# EAGLE design verstaerker (EAGLE 6.2)
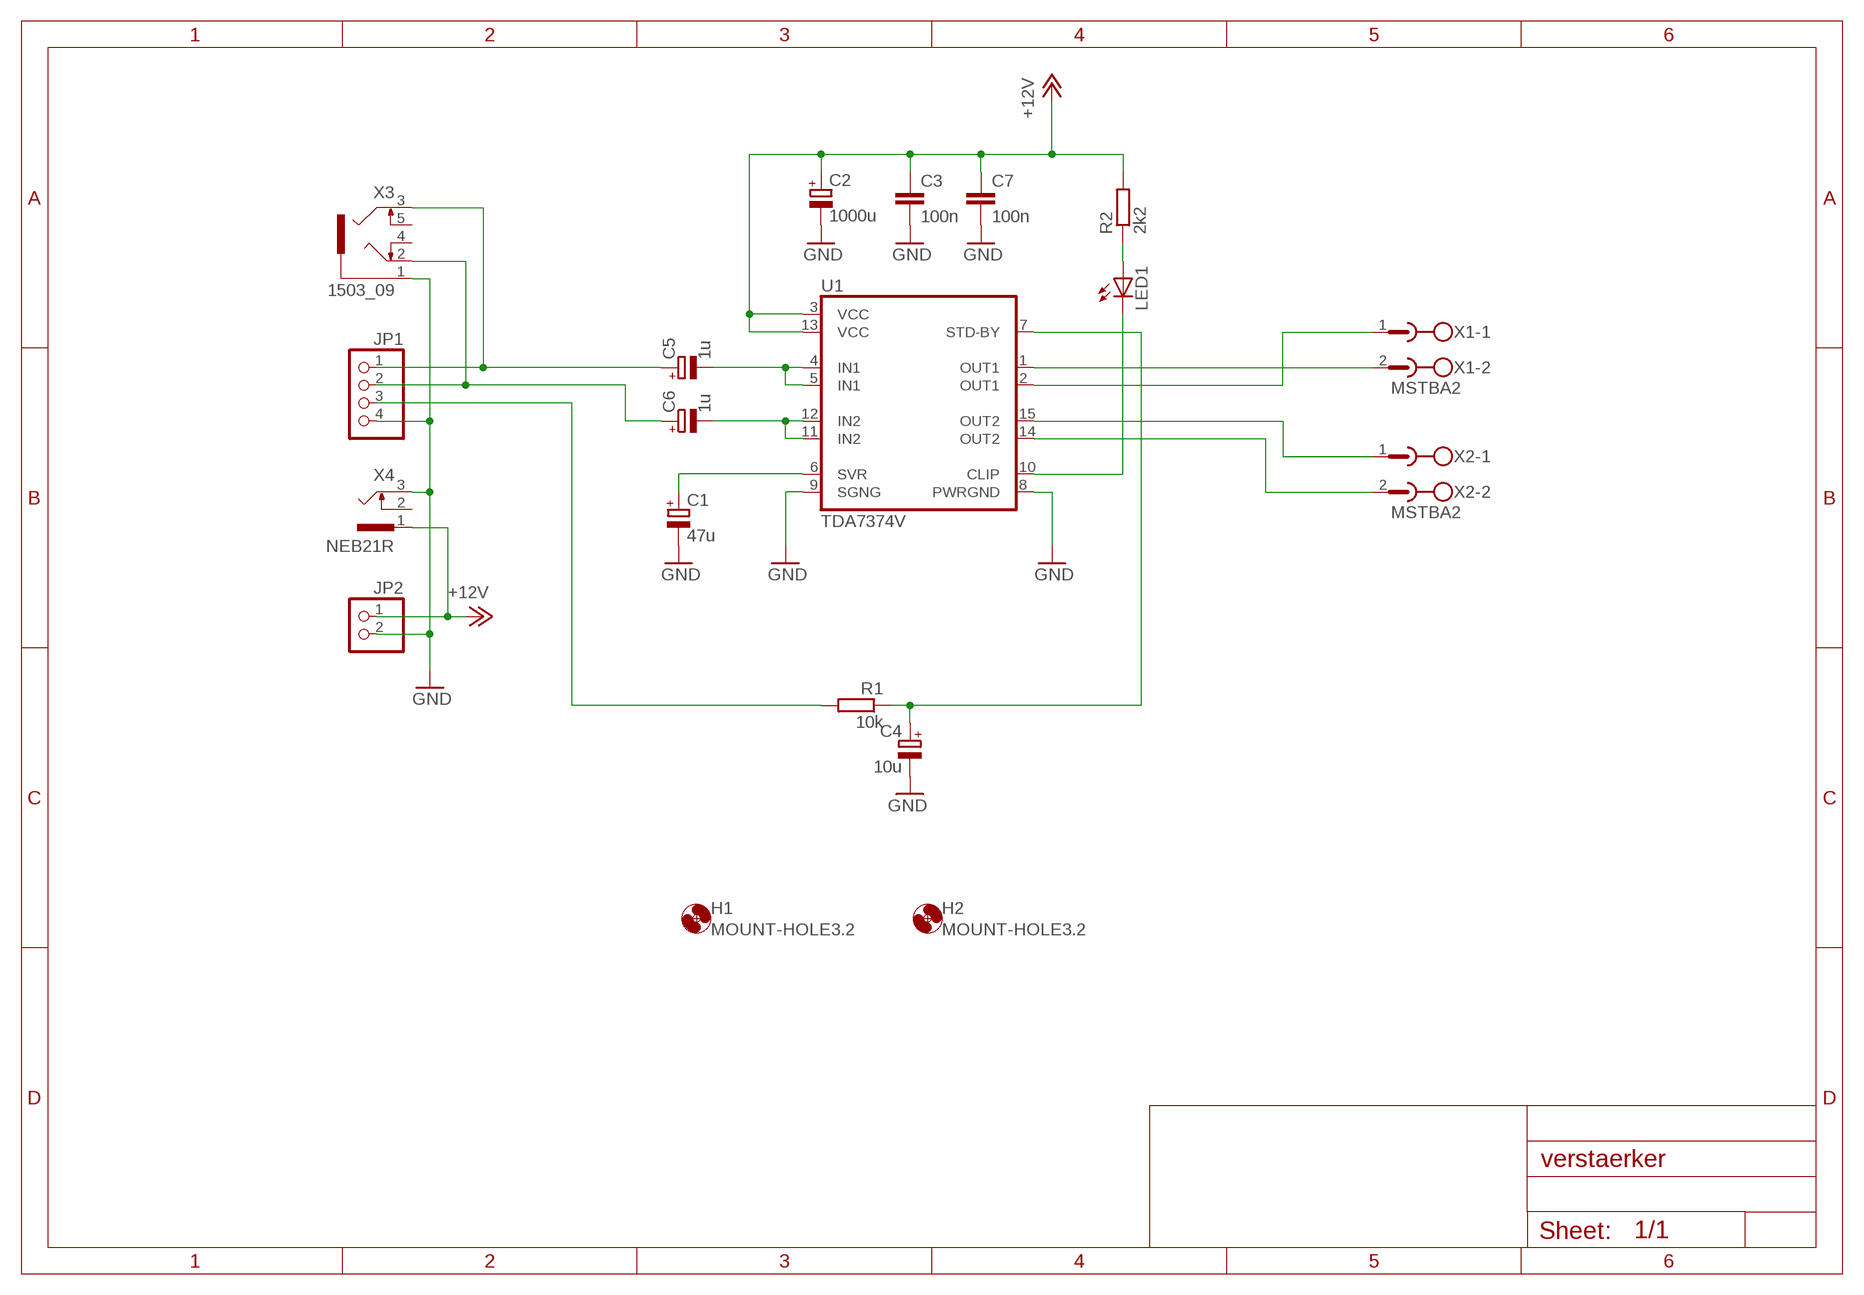
[diagram p0: schematic, sheet 1]

## Parts
C1  47u  CPOL-EUE2.5-7  [E2,5-7]
C2  1000u  CPOL-EUE3.5-8  [E3,5-8]
C3  100n  C-EU050-025X075  [C050-025X075]
C4  10u  CPOL-EUE2-5  [E2-5]
C5  1u  CPOL-EUE2.5-5  [E2,5-5]
C6  1u  CPOL-EUE2.5-5  [E2,5-5]
C7  100n  C-EU050-025X075  [C050-025X075]
H1  MOUNT-HOLE3.2  [3,2]
H2  MOUNT-HOLE3.2  [3,2]
JP1  PINHD-1X4  [1X04]
JP2  PINHD-1X2  [1X02]
LED1  LED5MM  [LED5MM]
R1  10k  R-EU_R0805  [R0805]
R2  2k2  R-EU_R0805  [R0805]
U1  TDA7374V  [MULTIWATT-15V]
X1  MSTBA2  [MSTBA2]
X2  MSTBA2  [MSTBA2]
X3  1503_09  [1503_09]
X4  NEB21R  [NEB21R]

## Nets
+12V: C2.+ C3.1 C7.1 JP2.1 R2.2 U1.3(VCC) U1.13(VCC) X4.1
GND: C1.- C2.- C3.2 C4.- C7.2 JP1.4 JP2.2 U1.8(PWRGND) U1.9(SGNG) X3.1 X4.3
N$1: C1.+ U1.6(SVR)
N$2: LED1.K(C) U1.10(CLIP)
N$3: C4.+ R1.1 U1.7(STD-BY)
N$4: JP1.3 R1.2
N$5: C5.+ JP1.1 X3.3
N$6: C6.- U1.11(IN2) U1.12(IN2)
N$7: LED1.A R2.1
N$8: C6.+ JP1.2 X3.2
N$9: C5.- U1.4(IN1) U1.5(IN1)
N$10: U1.1(OUT1) X1.2
N$11: U1.2(OUT1) X1.1
N$12: U1.14(OUT2) X2.2
N$13: U1.15(OUT2) X2.1
Unconnected: X3.4 X3.5 X4.2

## Library data of the parts
C1 C2 C4-C6 = rcl:CPOL-EU: POLARIZED CAPACITOR, European symbol
C3 C7 = rcl:C-EU: CAPACITOR, European symbol
H1 H2 = holes:MOUNT-HOLE: MOUNTING HOLE with drill center marker
JP1 = pinhead:PINHD-1X4: PIN HEADER
JP2 = pinhead:PINHD-1X2: PIN HEADER
LED1 = led:LED: LED OSRAM: - CHIPLED LG R971, LG N971, LY N971, LG Q971, LY Q971, LO R971, LY R971 LH N974, LH R974 LS Q976, LO Q976, LY Q976 LO Q996 - Hyper CHIPLED LW Q18S LB Q993, LB Q99A, LB R99A - SideLED LS A670, LO A670, LY A670, LG A670, LP A670 LB A673, LV A673, LT A673, LW A673 LH A674 LY A675 LS A676, LA A676, LO A676, LY A676, LW A676 LS A679, LY A679, LG A679 - Hyper Micro SIDELED® LS Y876, LA Y876, LO Y876, LY Y876 LT Y87S - SmartLED LW L88C, LW L88S LB L89C, LB L89S, LG L890 LS L89K, LO L89K, LY L89K LS L896, LA L896, LO L896, LY L896 - TOPLED LS T670, LO T670, LY T670, LG T670, LP T670 LSG T670, LSP T670, LSY T670, LOP T670, LYG T670 LG T671, LOG T671, LSG T671 LB T673, LV T673, LT T673, LW T673 LH T674 LS T676, LA T676, LO T676, LY T676, LB T676, LH T676, LSB T676, LW T676 LB T67C, LV T67C, LT T67C, LS T67K, LO T67K, LY T67K, LW E67C LS E67B, LA E67B, LO E67B, LY E67B, LB E67C, LV E67C, LT E67C LW T67C LS T679, LY T679, LG T679 LS T770, LO T770, LY T770, LG T770, LP T770 LB T773, LV T773, LT T773, LW T773 LH T774 LS E675, LA E675, LY E675, LS T675 LS T776, LA T776, LO T776, LY T776, LB T776 LHGB T686 LT T68C, LB T68C - Hyper Mini TOPLED® LB M676 - Mini TOPLED Santana® LG M470 LS M47K, LO M47K, LY M47K Source: http://www.osram.convergy.de LUXEON: - LUMILED® LXK2-PW12-R00, LXK2-PW12-S00, LXK2-PW14-U00, LXK2-PW14-V00 LXK2-PM12-R00, LXK2-PM12-S00, LXK2-PM14-U00 LXK2-PE12-Q00, LXK2-PE12-R00, LXK2-PE12-S00, LXK2-PE14-T00, LXK2-PE14-U00 LXK2-PB12-K00, LXK2-PB12-L00, LXK2-PB12-M00, LXK2-PB14-N00, LXK2-PB14-P00, LXK2-PB14-Q00 LXK2-PR12-L00, LXK2-PR12-M00, LXK2-PR14-Q00, LXK2-PR14-R00 LXK2-PD12-Q00, LXK2-PD12-R00, LXK2-PD12-S00 LXK2-PH12-R00, LXK2-PH12-S00 LXK2-PL12-P00, LXK2-PL12-Q00, LXK2-PL12-R00 Source: www.luxeon.com KINGBRIGHT: KA-3528ASYC Source: www.kingbright.com
R1 R2 = rcl:R-EU_: RESISTOR, European symbol
U1 = st-tda7375:TDA7374
X1 X2 = con-phoenix-508:MSTBA2: PHOENIX; MF: FARNELL; MPN: 1757242; OC_FARNELL: 3705171; OC_NEWARK: 71C4161
X3 = con-lumberg:1503_09: Jack connectors according to JISC 6560, 3.5 mm Klinkeneinbaukupplung nach JISC 6560, 3,5 mm, 3-polig/ stereo, abgewinkelte Ausführung, mit 2 Öffnern und Lötaugen, für Leiterplatten Rückseitenmontage Source: http://www.lumberg.com/Produkte/PDFs/1503_09.pdf; OC_FARNELL: 1243244; OC_NEWARK: unknown
X4 = con-lumberg:NEB21R: Netzgeräte-Einbaukupplung abgewinkelte Ausführung mit Öffner Source: http://www.lumberg.com/Produkte/PDFs/NEB21R.pdf; MPN: NEB 21 R; OC_FARNELL: 1217037; OC_NEWARK: 97K6458

## Board
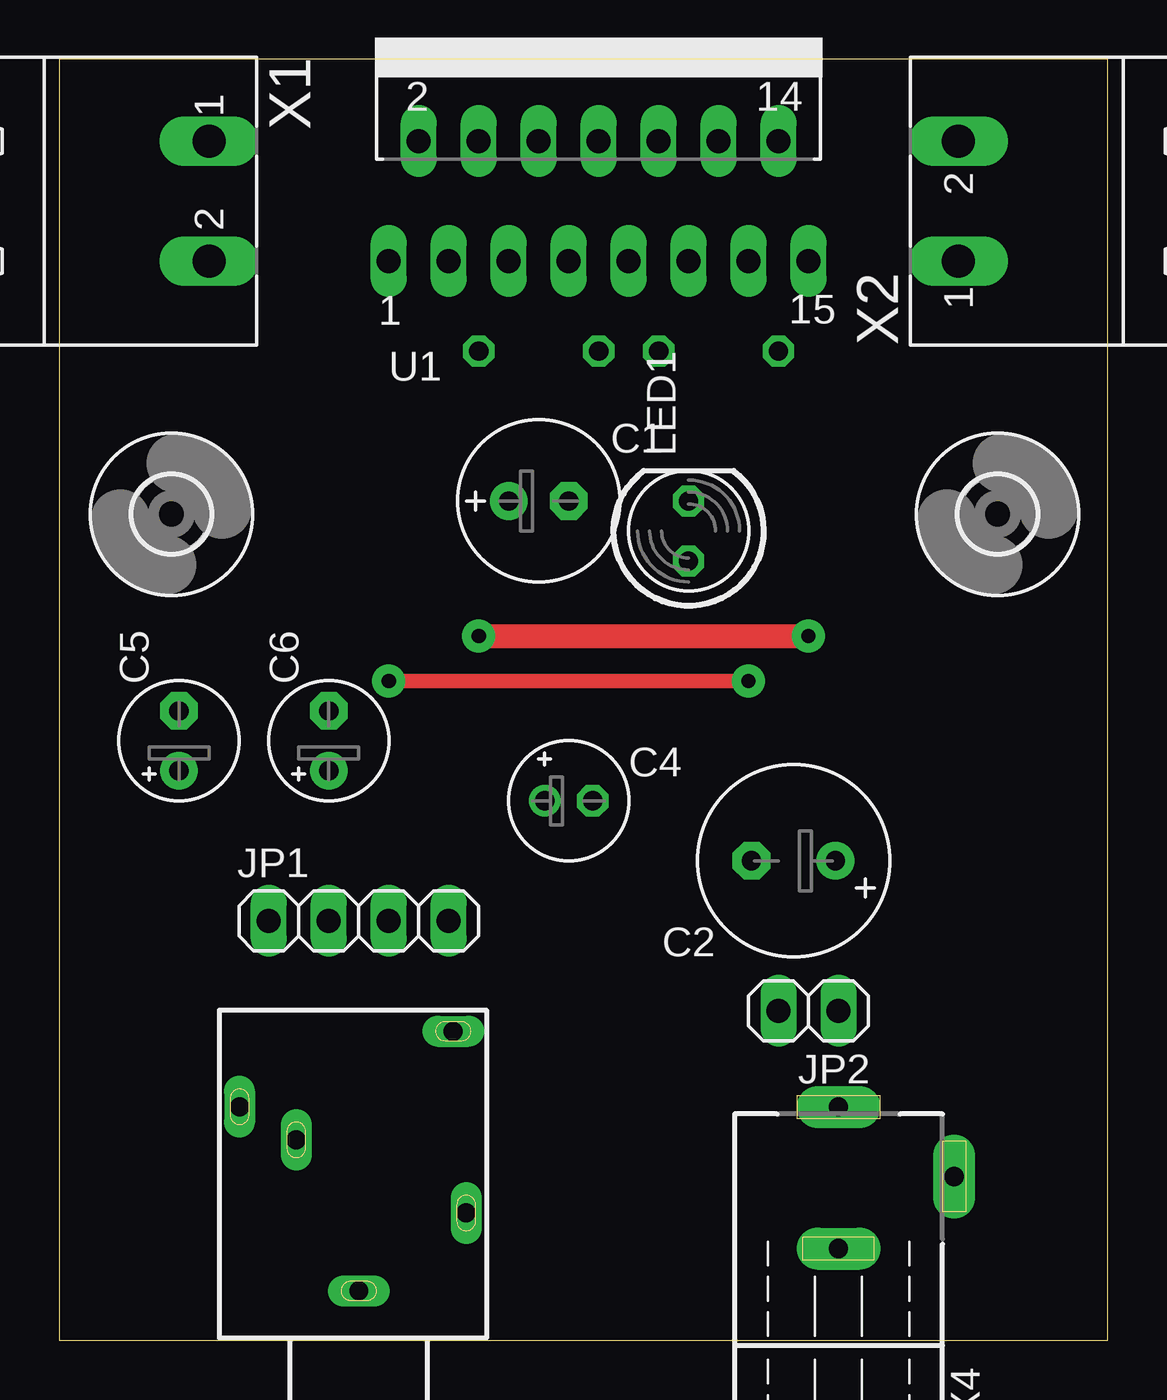
[diagram p1: board, top side]
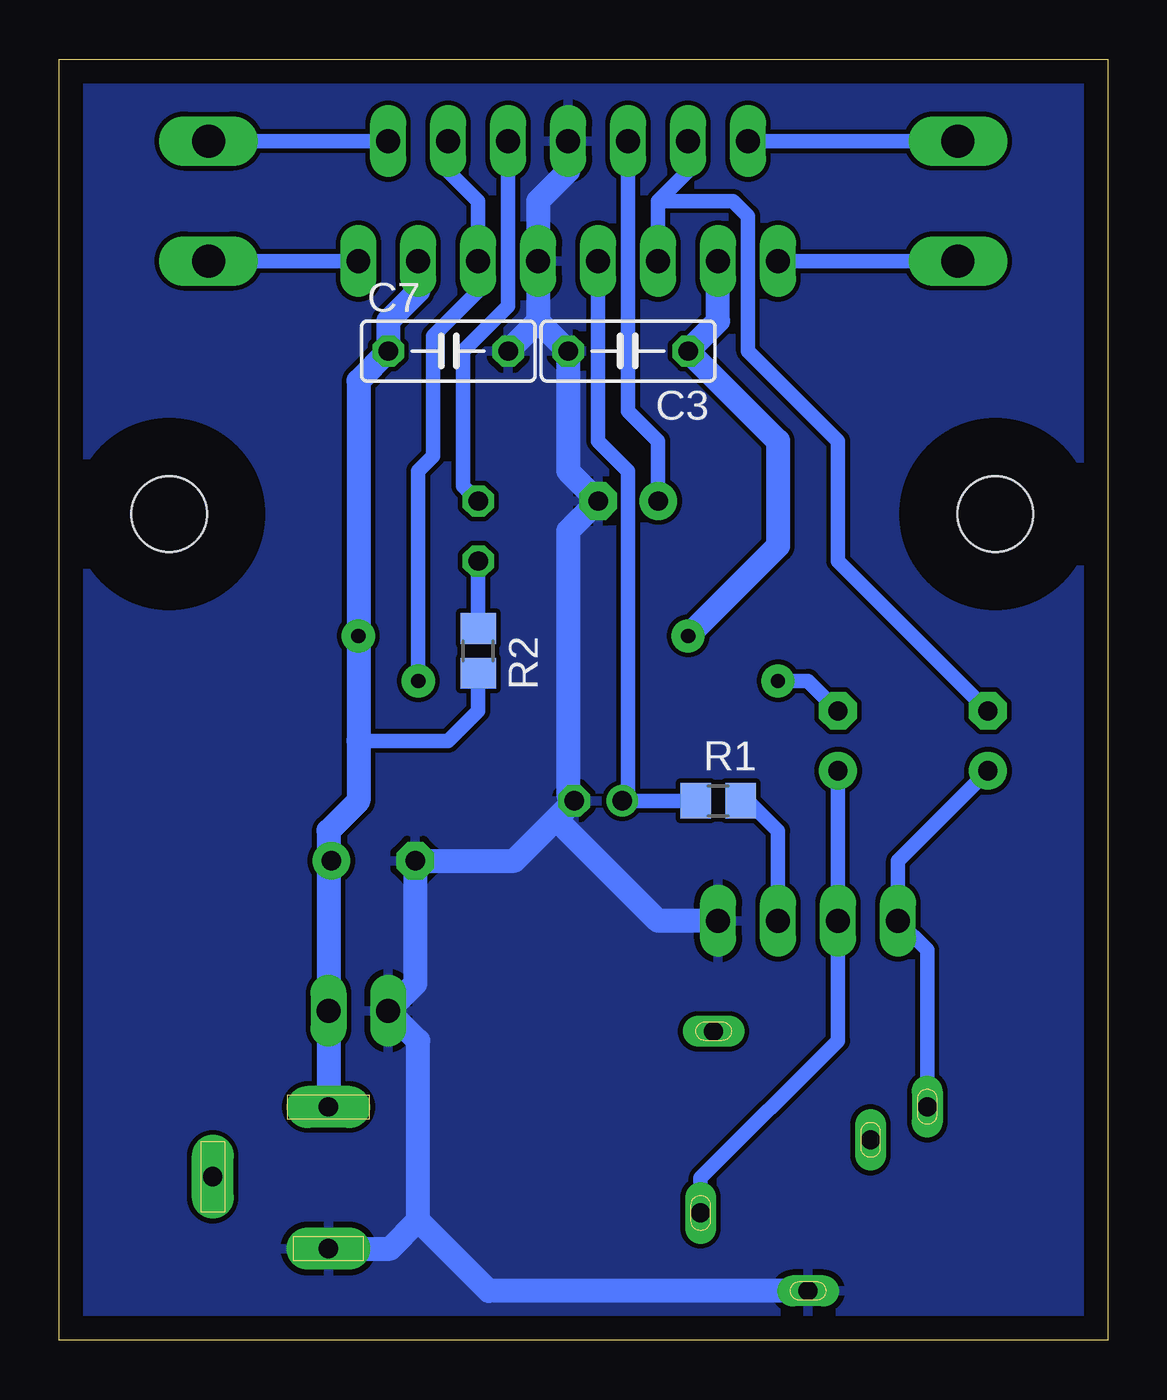
[diagram p2: board, bottom side, seen from below]

Size 44.43 x 54.28 mm. Coordinates in mm from the lower left corner, seen from the top.
Outline: 0,0 44.43,0 44.43,54.28 0,54.28 0,0
Copper layers (1*16): Top 0.035mm / dielectric 1.5mm / Bottom 0.035mm
Design rules "default": minimum track width 10mil, minimum drill 24mil, track to track 8mil, track to pad 8mil, pad to pad 8mil, via to via 8mil, smd to smd 8mil, copper to edge 40mil, drill to drill 8mil, minimum pad ring 10mil, minimum via ring 8mil, stop-mask expansion 4mil, vias tented up to drill 0mil, thermal gap 10mil

### Footprints (pad centres in the part's own frame; a part is rotated, then mirrored left to right if it is on the bottom)
E2,5-7 = drill 0.813 pad 1.6: + -1.27,0 | drill 0.813 pad 1.6 octagon: - 1.27,0
E3,5-8 = drill 0.813 pad 1.6: + -1.778,0 | drill 0.813 pad 1.6 octagon: - 1.778,0
C050-025X075 = drill 0.813 octagon: 1 -2.54,0; 2 2.54,0
E2-5 = drill 0.813 pad 1.27: + -1.016,0 | drill 0.813 pad 1.27 octagon: - 1.016,0
E2,5-5 = drill 0.813 pad 1.6: + -1.27,0 | drill 0.813 pad 1.6 octagon: - 1.27,0
3,2 = hole 3.2: 0,0
1X04 = drill 1.016 long: 1 -3.81,0; 2 -1.27,0; 3 1.27,0; 4 3.81,0
1X02 = drill 1.016 long: 1 -1.27,0; 2 1.27,0
LED5MM = drill 0.813 octagon: A -1.27,0; K 1.27,0
R0805 = smd 1.3 x 1.5: 1 -0.95,0; 2 0.95,0
MULTIWATT-15V = drill 1.016 long: 1 -8.89,-7.62; 2 -7.62,-2.54; 3 -6.35,-7.62; 4 -5.08,-2.54; 5 -3.81,-7.62; 6 -2.54,-2.54; 7 -1.27,-7.62; 8 0,-2.54; 9 1.27,-7.62; 10 2.54,-2.54; 11 3.81,-7.62; 12 5.08,-2.54; 13 6.35,-7.62; 14 7.62,-2.54; 15 8.89,-7.62
MSTBA2 = drill 1.397 long: 1 -2.54,5.08; 2 2.54,5.08
1503_09 = drill 0.8 pad 1.2 long: 1 0,-2.1; 2 -4.55,-5.4; 3 5.05,-9.9; 4 -4,-13.1; 5 2.65,-8.5
NEB21R = drill 0.813 pad 1.778 long: 1 0,7.35; 2 4.9,4.4; 3 0,1.35

### Placement (x,y rotation side)
C1  20.32,35.56 0 top
C2  31.11,20.32 180 top
C3  20.32,41.91 180 bottom
C4  21.59,22.86 0 top
C5  5.08,25.4 90 top
C6  11.43,25.4 90 top
C7  27.94,41.91 0 bottom
H1  4.76,35 0 top
H2  39.76,35 0 top
JP1  12.7,17.78 0 top
JP2  31.75,13.97 180 top
LED1  26.67,34.29 90 top
R1  16.51,22.86 0 bottom
R2  26.67,29.21 270 bottom
U1  22.86,53.34 0 top
X1  1.27,48.26 270 top
X2  43.18,48.26 90 top
X3  12.7,0 180 top
X4  33.02,2.54 0 top

### Tracks (layer width: path | path; a pad name or v marks a point on that pad's centre or on a via)
+12V  (via drill 0.6 pad 1.4)
  Top 1.016: v17.78,29.84 v31.75,29.84
  Bottom 0.61: R2.2 26.67,26.67 27.94,25.4 31.75,25.4
  Bottom 1.016: v17.78,29.84 13.97,33.66 13.97,38.1 C3.1 16.51,43.18 U1.3 | 33.02,20.32 33.02,21.59 31.75,22.86 31.75,25.4 v31.75,29.84 31.75,40.64 C7.1 30.48,43.18 29.21,44.45 U1.13 | 33.02,20.32 JP2.1 X4.1 | C2.+ 33.02,20.32
GND
  Bottom 1.016: X4.3 30.4,3.89 29.21,5.08 | 29.21,5.08 29.21,12.7 JP2.2 29.34,15.11 C2.- 25.15,20.32 23.37,22.1 | 23.37,22.1 C4.- 22.86,23.11 22.86,34.29 C1.- 22.86,36.83 C3.2 24.13,43.18 | JP1.4 19.05,17.78 23.37,22.1 | X3.1 26.23,2.1 29.21,5.08 | 24.13,43.18 U1.9 24.13,48.26 22.86,49.53 U1.8 | C7.2 24.13,43.18
  pour Bottom: 0,54.61 44.45,54.61 44.45,0 0,0
N$1
  Bottom 0.61: U1.6 20.32,39.37 19.05,38.1 C1.+
N$2
  Bottom 0.61: U1.10 25.4,43.81 27.3,41.91 27.3,36.2 LED1.K
N$3
  Bottom 0.61: R1.1 C4.+ 20.32,23.11 20.32,36.83 21.59,38.1 U1.7
N$4
  Bottom 0.61: JP1.3 13.97,21.59 15.24,22.86 R1.2
N$5
  Bottom 0.61: X3.3 7.65,16.54 JP1.1 8.89,20.32 C5.+
N$6  (via drill 0.6 pad 1.4)
  Top 0.61: v29.21,27.94 v13.97,27.94
  Bottom 0.61: U1.12 27.94,49.53 26.67,48.26 U1.11 26.67,44.45 28.57,42.55 28.57,37.47 29.21,36.83 v29.21,27.94 | v13.97,27.94 12.7,27.94 C6.-
N$7
  Bottom 0.61: LED1.A R2.1
N$8
  Bottom 0.61: X3.2 17.25,6.88 11.43,12.7 JP1.2 C6.+
N$9
  Bottom 0.61: U1.4 17.78,49.53 19.05,48.26 | 19.05,48.26 U1.5 | 19.05,48.26 15.87,48.26 15.24,47.62 15.24,41.91 11.43,38.1 11.43,33.02 C5.-
N$10
  Bottom 0.61: U1.1 X1.2
N$11
  Bottom 0.61: U1.2 X1.1
N$12
  Bottom 0.61: U1.14 X2.2
N$13
  Bottom 0.61: U1.15 X2.1